# Altium schematic sheet Power_management.SchDoc: Power management
size A4; Date: Not used; ApprovedBy: Not used; CheckedBy: Not used; Author: Not used; CompanyName: STMicroelectronics; DrawnBy: Not used; Engineer: Not used; Organization: Not used; Address1: Not used; Address2: Not used; Address3: Not used; Address4: Not used; DocumentNumber: Not used; Revision: Not used; SheetNumber: 7; SheetTotal: 8; CurrentTime: Not used; CurrentDate: Not used; Time: Not used; DocumentFullPathAndName: Not used; DocumentName: Not used; ModifiedDate: Not used; ImagePath: Not used; ProjectName: Not used; Application_BuildNumber: Not used
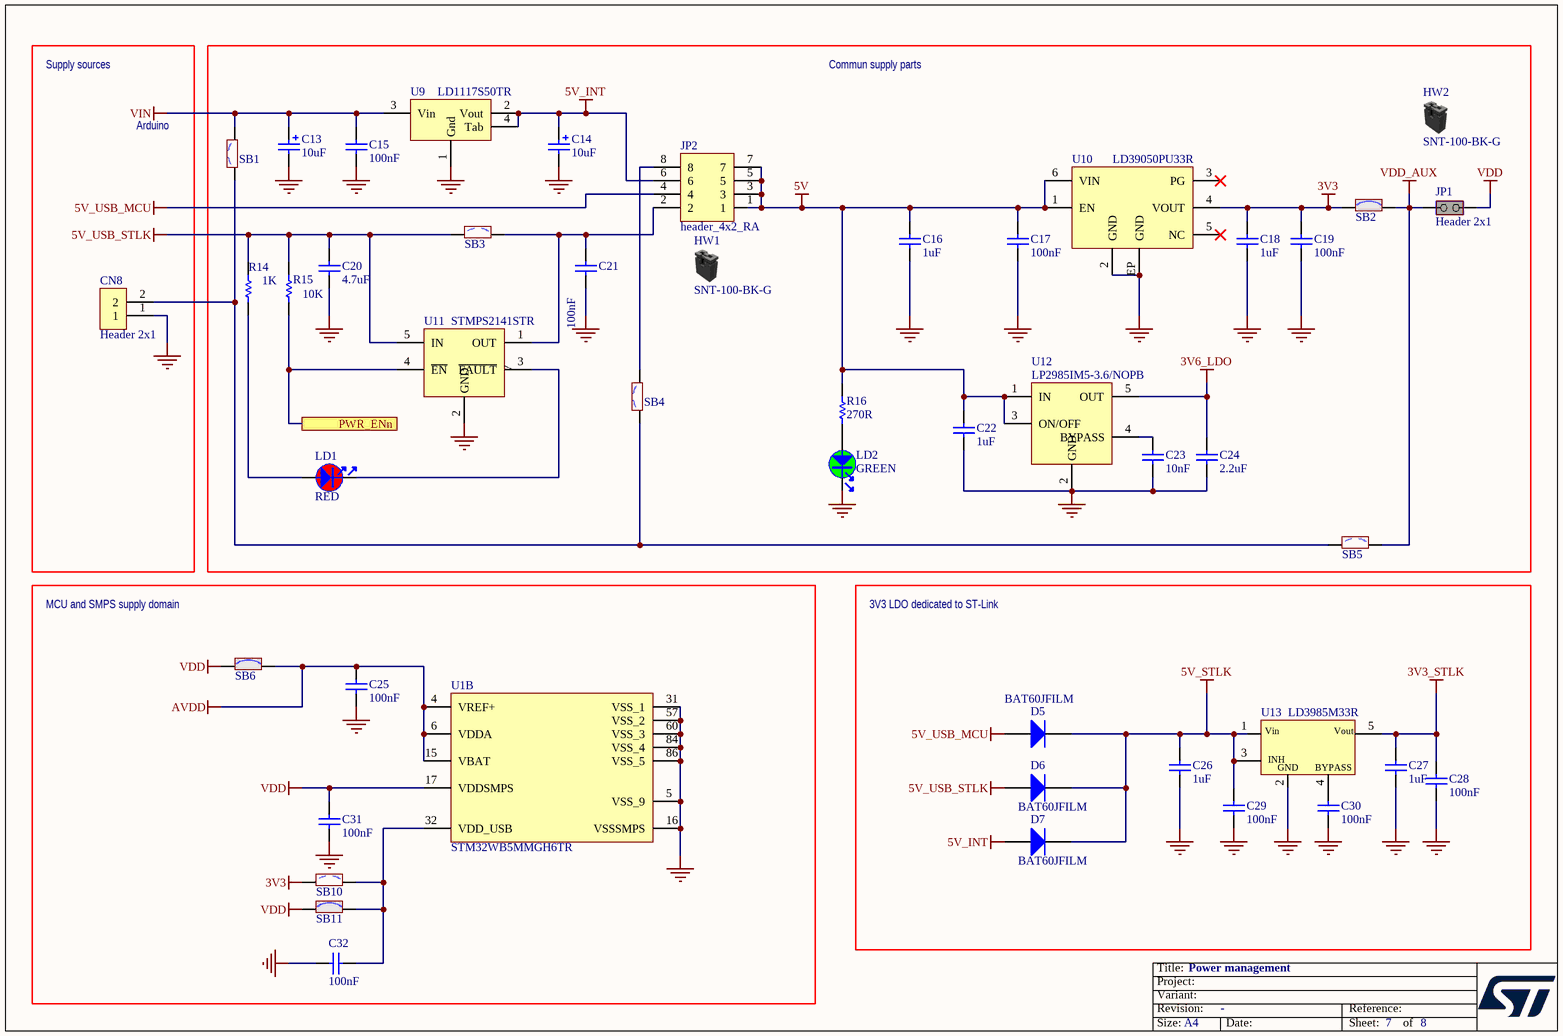
[diagram p0: Power_management.SchDoc]

## Parts
C13  value 10uF  [CPOL_TAJ-B_1210_H210]  (hidden comment: Cap_POL_TANA)
C14  value 10uF  [CPOL_TAJ-B_1210_H210]  (hidden comment: Cap_POL_TANA)
C15  value 100nF  [C0805_H0P85]  (hidden comment: Capacitor)
C16  value 1uF  [C0805_H0P85]  (hidden comment: Capacitor)
C17  value 100nF  [C0201_H0P3]  (hidden comment: Capacitor)
C18  value 1uF  [C0805_H0P85]  (hidden comment: Capacitor)
C19  value 100nF  [C0201_H0P3]  (hidden comment: Capacitor)
C20  value 4.7uF  [C0603_H0P8]  (hidden comment: Capacitor)
C21  value 100nF  [C0805_H0P85]  (hidden comment: Capacitor)
C22  value 1uF  [C0603]  (hidden comment: Capacitor)
C23  value 10nF  [C0603]  (hidden comment: Capacitor)
C24  value 2.2uF  [C0603]  (hidden comment: Capacitor)
C25  value 100nF  [C0201_H0P3]  (hidden comment: Capacitor)
C26  value 1uF  [C0402]  (hidden comment: Capacitor)
C27  value 1uF  [C0402]  (hidden comment: Capacitor)
C28  value 100nF  [C0201_H0P3]  (hidden comment: Capacitor)
C29  value 100nF  [C0201_H0P3]  (hidden comment: Capacitor)
C30  value 100nF  [C0201_H0P3]  (hidden comment: Capacitor)
C31  value 100nF  [C0201_H0P3]  (hidden comment: Capacitor)
C32  value 100nF  [C0201_H0P3]  (hidden comment: Capacitor)
CN8  Header 2x1  [CON_LYCONN_313102S141346]
D5  BAT60JFILM  [DIO_SOD323]
D6  BAT60JFILM  [DIO_SOD323]
D7  BAT60JFILM  [DIO_SOD323]
HW1  value SNT-100-BK-G  (hidden comment: Shunt Black 2.54mm)  (mechanical)
HW2  value SNT-100-BK-G  (hidden comment: Shunt Black 2.54mm)  (mechanical)
JP1  value Header 2x1  [CON_SAMTEC_TSW-102-07-G-S]  (hidden comment: Jumper_Header 2x1 Fitted)
JP2  value header_4x2_RA  [CON_SAMTEC_TSW-104-08-F-D-RA]  (hidden comment: Header 4x2)
LD1  value RED  [LED_0603_VISHAY_VLMS1300-GS08_RED_1A2K_H0P8]  (hidden comment: LED_red)
LD2  value GREEN  [LED_0603_OSRAM_LG-Q396-PS-35_GREEN_1A2K_H0P4]  (hidden comment: LED_green)
R14  value 1K  [R0603]  (hidden comment: Resistor)
R15  value 10K  [R0603]  (hidden comment: Resistor)
R16  value 270R  [R0603]  (hidden comment: Resistor)
SB1  SB_OFF  [SOLDER-BRIDGE_R0603-0R]  (value not drawn)
SB2  SB_ON  [SOLDER-BRIDGE_R0603-0R]  (value not drawn)
SB3  SB_OFF  [SOLDER-BRIDGE_R0603-0R]  (value not drawn)
SB4  SB_OFF  [SOLDER-BRIDGE_R0603-0R]  (value not drawn)
SB5  SB_OFF  [SOLDER-BRIDGE_R0603-0R]  (value not drawn)
SB6  SB_ON  [SOLDER-BRIDGE_R0603-0R]  (value not drawn)
SB10  SB_OFF  [SOLDER-BRIDGE_R0603-0R]  (value not drawn)
SB11  SB_ON  [SOLDER-BRIDGE_R0603-0R]  (value not drawn)
U1  STM32WB5MMGH6TR  [MOD_DORY_STM_86P_7P3X11_H1P342]  (part B of 2)
U9  LD1117S50TR  [REG_SOT223-TAB]
U10  LD39050PU33R  [ICC_DFN6-EPAD_3X3_P095]
U11  STMPS2141STR  [MOS_SOT23-5L]
U12  LP2985IM5-3.6/NOPB  [REG_SOT23-5L]
U13  LD3985M33R  [REG_SOT23-5L]

## Blocks framed on the sheet
Commun supply parts: C13-C24 HW1 HW2 JP1 JP2 LD1 LD2 R14-R16 SB1-SB5 U9-U12
MCU and SMPS supply domain: C25 C31 C32 SB6 SB10 SB11 U1
3V3 LDO dedicated to ST-Link: C26-C30 D5-D7 U13

## Ports
PWR_ENn

## Nets
3V3: C18.2 C19.2 SB2.1 SB10.1 U10.4(VOUT)
3V3_STLK: C27.2 C28.2 U13.5(Vout)
3V6_LDO: C24.2 U12.5(OUT)
5V: C16.2 C17.2 C22.1 JP2.1 JP2.3 JP2.5 JP2.7 R16.2 U10.1(EN) U10.6(VIN) U12.1(IN) U12.3(ON/OFF)
5V_INT: C14.1 D7.1(A) JP2.6 U9.2(Vout) U9.4(Tab)
5V_STLK: C26.2 C29.2 D5.2(K) D6.2(K) D7.2(K) U13.1(Vin) U13.3(CE)
5V_USB_MCU: D5.1(A) JP2.4
5V_USB_STLK: C20.2 D6.1(A) R14.2 R15.2 SB3.1 U11.5(IN)
AVDD: C25.2 SB6.2 U1.4(VREF+) U1.6(VDDA) U1.15(VBAT)
GND: C13.2 C14.2 C15.1 C16.1 C17.1 C18.1 C19.1 C20.1 C21.1 C22.2 C23.1 C24.1 C25.1 C26.1 C27.1 C28.1 C29.1 C30.1 C31.1 C32.2 CN8.1 LD2.2 U1.5(VSS_9) U1.16(VSSSMPS) U1.31(VSS_1) U1.57(VSS_2) U1.60(VSS_3) U1.84(VSS_4) U1.86(VSS_5) U9.1(Gnd) U10.2(GND) U10.EP(GND) U11.2(GND) U12.2(GND) U13.2(GND)
VDD: C31.2 JP1.2(NO) SB6.1 SB11.1 U1.17(VDDSMPS)
VDD_AUX: JP1.1(COMMON) SB2.2 SB5.2
VIN: C13.1 C15.2 SB1.2 U9.3(Vin)
PWR_ENn: R15.1 U11.4(~{EN}) ; port PWR_ENn
NetC21_2: C21.2 JP2.2 SB3.2 U11.1(OUT)
NetC23_2: C23.2 U12.4(BYPASS)
NetC30_2: C30.2 U13.4(BYPASS)
NetC32_1: C32.1 SB10.2 SB11.2 U1.32(VDD_USB)
NetCN8_2: CN8.2 SB1.1 SB4.1 SB5.1
NetJP2_8: JP2.8 SB4.2
NetLD1_1: LD1.1 R14.1
NetLD1_2: LD1.2 U11.3(~{FAULT})
NetLD2_1: LD2.1 R16.1

Not connected (* = marked no-connect by the designer): U10 3(PG)* 5(NC)*

## Notes on the sheet
- Supply sources
- Arduino
- Title:
- Project:
- Size:
- Revision:
- Variant:
- A4
- -
- Date:
- Reference:
- Sheet:
- of
- (in symbol MCD-00086) INH

## Library data of the parts
C13 C14 = MCD-00324: Capacitor, Tantalum, 10uF, 25V,2.5ohms, 10%, pkg Type_B (3528 metric), T=1.9mm; Manufacturer_Part_Number: TAJB106K025RNJ; Manufacturer: AVX; Part_Preference: Recommended; Order_Code_RS: 136-0159; Revision: July-2002: Re-released for DXP Platform.; Internal_Part_Number: MCD-00324; Status: Released; Part_Type: Capacitor; Package: Type_B; ComponentLink1URL: http://tunmcdsvn.tun.st.com/Component_Datasheet_Library/Trunk/Capacitors/AVX_Capacitor_TAJ-series; Order_Code_Digikey: 478-5257-1-ND; Order_Code_Farnell: 2333024
C15 C21 = MCD-01525: Capacitor, MLCC, 100nF, 50V, X7R, 10%, 0805, T=0,85mm; Manufacturer_Part_Number: CC0805KRX7R9BB104; Manufacturer: YAGEO; BMS_Part_Number: 9142249; Part_Preference: Recommended; Order_Code_RS: 669-8842; Internal_Part_Number: MCD-01525; Status: Released; Part_Type: Capacitor; Package: C0805; ComponentLink1URL: http://tunmcdsvn.tun.st.com/Component_Datasheet_Library/Trunk/Capacitors/Yageo_Multilayer_Capacitor_X7R_series_100pF_to_22uF/Yageo_Mutilayer_Capacitor_X7R_100pF_to_22uF.pdf; Order_Code_Digikey: 311-1140-1-ND; Order_Code_Farnell: 3019949
C16 C18 = MCD-01550: Capacitor, MLCC, 1uF, 16V, X5R, +/-10%, 0805, T=0.85mm; Manufacturer_Part_Number: CC0805KRX5R7BB105; Manufacturer: YAGEO; Part_Preference: Recommended; Internal_Part_Number: MCD-01550; Status: Released; Part_Type: Capacitor; Alternate_Manufacturer_Part_Number: N/A; Alternate_Manufacturer: N/A; Package: C0805; ComponentLink1URL: http://tunmcdsvn.tun.st.com/Component_Datasheet_Library/Trunk/Capacitors/Yageo_Multilayer_Capacitor_X7R_series_100pF_to_22uF/YAGEO_MLCC_UPY-GPHC_X7R_6.3V-to-50V_18.pdf; Order_Code_Digikey: 311-3427-1-ND; Order_Code_Farnell: N/A; Order_Code_RS: N/A
C17 C19 C25 C28-C32 = MCD-01535: Capacitor, MLCC,100nF, 10V, X7R, +/-10%, 0201, T=0.3mm; Manufacturer_Part_Number: GRM033R61A104KE15; Manufacturer: MURATA; Part_Preference: Recommended; Order_Code_RS: 790-2742; Internal_Part_Number: MCD-01535; Status: Checked; Part_Type: Capacitor; Package: C0201; ComponentLink1URL: http://tunmcdsvn.tun.st.com/Component_Datasheet_Library/Trunk/Capacitors/Murata_Capacitor_GR_series; Alternate_Manufacturer: N/A; Alternate_Manufacturer_Part_Number: N/A; Order_Code_Digikey: 490-5881-1-ND; Order_Code_Farnell: 2470450
C20 = MCD-01721: Capacitor, MLCC, 4.7uF, 10V, X5R, +/-10%, 0603, T=0.8mm; Manufacturer_Part_Number: CC0603KRX5R6BB475; Manufacturer: YAGEO; Part_Preference: Recommended; Internal_Part_Number: MCD-01721; Status: Released; Part_Type: Capacitor; Package: C0603; ComponentLink1URL: http://tunmcdsvn.tun.st.com/Component_Datasheet_Library/Trunk/Capacitors/Yageo_Multilayer_capacitor_X5R_series_100pF_to_100uF/YAGEO_MLCC_UPY-GPHC_X5R_4V-to-50V_25.pdf; Order_Code_Digikey: 311-1455-1-ND; Order_Code_Farnell: 1458898; Order_Code_RS: N/A
C22 = MCD-00010: Capacitor, MLCC, 1uF, 16V, X5R, +/-10%, 0603, T=0,8mm; Manufacturer_Part_Number: CC0603KRX5R7BB105; Manufacturer: YAGEO; Part_Preference: Recommended; Internal_Part_Number: MCD-00010; Status: Released; Part_Type: Capacitor; Package: C0603; ComponentLink1URL: http://tunmcdsvn.tun.st.com/Component_Datasheet_Library/Trunk/Capacitors/Yageo_Multilayer_capacitor_X5R_series_100pF_to_100uF; Order_Code_Digikey: 311-1444-1-ND; Order_Code_Farnell: 2370680; Order_Code_RS: N/A
C23 = MCD-01007: Capacitor, MLCC, 10nF, 16V, X7R, +/-10%, 0603, T=0.8mm; Manufacturer_Part_Number: CC0603KRX7R7BB103; Manufacturer: YAGEO; Part_Preference: Recommended; Internal_Part_Number: MCD-01007; Status: Released; Part_Type: Capacitor; Package: C0603; ComponentLink1URL: http://tunmcdsvn.tun.st.com/Component_Datasheet_Library/Trunk/Capacitors/Yageo_Multilayer_Capacitor_X7R_series_100pF_to_22uF/; Order_Code_Digikey: 311-3369-1-ND; Order_Code_Farnell: N/A; Order_Code_RS: N/A
C24 = MCD-00012: Capacitor, MLCC, 2.2uF, 10V, X5R, +/- 10%, 0603, T=0,8mm; Manufacturer_Part_Number: CC0603KRX5R6BB225; Manufacturer: YAGEO; Alternate_Manufacturer_Part_Number: C0603C225K8PACTU; Alternate_Manufacturer: KEMET; BMS_Part_Number: 9142010; Part_Preference: Recommended; Internal_Part_Number: MCD-00012; Status: Released; Part_Type: Capacitor; Package: C0603; ComponentLink1URL: http://tunmcdsvn.tun.st.com/Component_Datasheet_Library/Trunk/Capacitors/Yageo_Multilayer_capacitor_X5R_series_100pF_to_100uF; Order_Code_Digikey: 311-1451-1-ND; Order_Code_Farnell: 2370679; Order_Code_RS: N/A
C26 C27 = MCD-01722: Capacitor, MLCC, 1uF, 10V, X5R, +/-10%, 0402, T=0.5mm; Manufacturer_Part_Number: CC0402KRX5R6BB105; Manufacturer: YAGEO; Part_Preference: Recommended; Internal_Part_Number: MCD-01722; Status: Released; Part_Type: Capacitor; Package: C0402; ComponentLink1URL: http://tunmcdsvn.tun.st.com/Component_Datasheet_Library/Trunk/Capacitors/Yageo_Multilayer_capacitor_X5R_series_100pF_to_100uF/Yageo_Multilayer_capacitor_X5R_100pF_to_100uF.pdf; Order_Code_Digikey: 311-1439-1-ND; Order_Code_Farnell: 1458896; Order_Code_RS: N/A
CN8 = MCD-01668: Header 2x1, 2.54mm, VR, TH, height 5.84mm/5.08 mm, height total 13.46 mm; Part_Type: Connector; Manufacturer_Part_Number: 313102S141346; Manufacturer: LYCONN; Part_Preference: Recommended; Internal_Part_Number: MCD-01668; Value: Header 2x1; Status: Released; ComponentLink1URL: http://tunmcdsvn.tun.st.com/Component_Datasheet_Library/Trunk/Connectors/LYCONN_31XXX_2.54mm_L13.46mm/LYCONN_31XXX_2.54mm_L13.46mm.pdf
D5-D7 = MCD-00034: Manufacturer: STMICROELECTRONICS; Part_Type: Diode; BMS_Part_Number: 9151097; Part_Preference: Recommended; Manufacturer_HQ_COO: EU; Internal_Part_Number: MCD-00034; Value: BAT60JFILM; Manufacturer_Part_Number: BAT60JFILM; Status: Released; ComponentLink1URL: http://tunmcdsvn.tun.st.com/Component_Datasheet_Library/Trunk/Diodes/STM_Diode_BAT60JFILM-SOD323
HW1 HW2 = MCD-00043: SHUNT 2.54mm BLACK; Part_Type: Misc; Manufacturer: SAMTEC; Alternate_Manufacturer_Part_Number: 316102S111A; Alternate_Manufacturer: JIUBABA; Part_Preference: Recommended; Internal_Part_Number: MCD-00043; Status: Released; Manufacturer_Part_Number: SNT-100-BK-G; ComponentLink1URL: http://tunmcdsvn.tun.st.com/Component_Datasheet_Library/Trunk/Connectors/Samtec_Shunt_Jumper_SNT100
JP1 = MCD-01904: Header, 2x1, 2,54mm, VR, TH, Height 5.84mm/2.54mm - Shunt Fitted by default; Part_Type: Connector; Manufacturer_Part_Number: TSW-102-07-G-S; Manufacturer: SAMTEC; Part_Preference: Recommended; Order_Code_RS: 155-7981; Internal_Part_Number: MCD-01904; Status: Checked; ComponentLink1URL: http://tunmcdsvn.tun.st.com/Component_Datasheet_Library/Trunk/Connectors/Samtec_TSW-HTSW-series; Alternate_Manufacturer: N/A; Alternate_Manufacturer_Part_Number: N/A; Order_Code_Digikey: SAM1029-02-ND; Order_Code_Farnell: 2505044
JP2 = MCD-02037: Header, 4x2, 2,29mm, RA, TH, height 5,84mm; Part_Type: Connector; Manufacturer_Part_Number: TSW-104-08-F-D-RA; Manufacturer: SAMTEC; Part_Preference: Recommended; Internal_Part_Number: MCD-02037; Status: Released; ComponentLink1URL: http://tunmcdsvn.tun.st.com/Component_Datasheet_Library/Trunk/Connectors/Samtec_TSW-HTSW-series/; Order_Code_Digikey: SAM13034-ND; Order_Code_Farnell: 2032652; Order_Code_RS: N/A; Alternate_Manufacturer_Part_Number: N/A; Alternate_Manufacturer: N/A
LD1 = MCD-00587: LED Red, 0603 SMD, 2V Forward Voltage; Part_Type: Display; Part_Preference: Recommended; Manufacturer: VISHAY; Manufacturer_Part_Number: VLMS1300-GS08; Full_Alternate_Internal_Part_Number: MCD-02401; Component_Country_Of_Origin: China; ShowFields: YES; ID: 3154; Internal_Part_Number: MCD-00587; Status: Released; Package: LED 0603; ComponentLink1URL: http://tunmcdsvn.tun.st.com/Component_Documentation_Library/Trunk/Display/VISHAY_VLMx1300-GS08_Series; Order_Code_Digikey: VLMS1300-GS08CT-ND; Order_Code_Farnell: 2078728; Order_Code_RS: N/A
LD2 = MCD-00588: LED Green, 0603 SMD, Forward Voltage Typ=2V, Max=2.5V; Part_Type: Display; Manufacturer_Part_Number: LG Q396-PS-35; Manufacturer: OSRAM OPTO SEMICONDUCTORS; Alternate_Manufacturer_Part_Number: VLMTG1300-GS08; Alternate_Manufacturer: VISHAY SEMICONDUCTOR OPTO DIVISION; Part_Preference: Recommended; Internal_Part_Number: MCD-00588; Status: Released; Package: LED 0603; ComponentLink1URL: http://tunmcdsvn.tun.st.com/Component_Datasheet_Library/Trunk/Display/OSRAM_LED_GREEN_LG Q396-PS-35; Order_Code_Digikey: LG Q396-PS-35-ND
R14 = MCD-00070: Resistor,1K,0603,1%,1/10W; Manufacturer_Part_Number: RC0603FR-071KL; Manufacturer: YAGEO; Part_Preference: Recommended; Internal_Part_Number: MCD-00070; Status: Released; Part_Type: Resistor; Package: R0603; ComponentLink1URL: http://tunmcdsvn.tun.st.com/Component_Datasheet_Library/Trunk/Resistors/Yageo_Resistor_RC0603-series; Order_Code_Digikey: 311-1.00KHRCT-ND; Order_Code_Farnell: 9238484RL; Order_Code_RS: N/A
R15 = MCD-00220: Resistor,10K,0603,1%,1/10W; Manufacturer_Part_Number: RC0603FR-0710KL; Manufacturer: YAGEO; Part_Preference: Recommended; Internal_Part_Number: MCD-00220; Status: Released; Part_Type: Resistor; Package: R0603; ComponentLink1URL: http://tunmcdsvn.tun.st.com/Component_Datasheet_Library/Trunk/Resistors/Yageo_Resistor_RC0603-series; Order_Code_Digikey: 311-10.0KHRCT-ND; Order_Code_Farnell: 9238603; Order_Code_RS: N/A
R16 = MCD-00442: Resistor,270R,0603,1%,1/10W; Manufacturer_Part_Number: RC0603FR-07270RL; Manufacturer: YAGEO; Part_Preference: Recommended; Internal_Part_Number: MCD-00442; Status: Released; Part_Type: Resistor; Package: R0603; ComponentLink1URL: http://tunmcdsvn.tun.st.com/Component_Datasheet_Library/Trunk/Resistors/Yageo_Resistor_RC0603-series; Order_Code_Digikey: 311-270HRCT-ND; Order_Code_Farnell: 9238417; Order_Code_RS: N/A
SB1 SB3-SB5 SB10 = MCD-00072: Solder Bridge OFF; Part_Type: Misc; Manufacturer_Part_Number: RC0603JR-070RL; Manufacturer: YAGEO; Part_Preference: Recommended; Internal_Part_Number: MCD-00072; Status: Released; Package: SB0603; ComponentLink1URL: http://tunmcdsvn.tun.st.com/Component_Datasheet_Library/Trunk/Resistors/Yageo_Resistor_RC0603-series
SB2 SB6 SB11 = MCD-00071: Solder Bridge ON; Part_Type: Misc; Manufacturer_Part_Number: RC0603JR-070RL; Manufacturer: YAGEO; Part_Preference: Recommended; Internal_Part_Number: MCD-00071; Status: Released; Package: SB0603; ComponentLink1URL: http://tunmcdsvn.tun.st.com/Component_Datasheet_Library/Trunk/Resistors/Yageo_Resistor_RC0603-series
U1 = MCD-01965: STM32 BLE module based on STM32WB55; Part_Type: Misc; Manufacturer: STMICROELECTRONICS; Part_Preference: Recommended; Manufacturer_HQ_COO: EU; Component_Country_Of_Origin: Taiwan; Value: STM32WB5MMGH6TR; Order_Code_Digikey: N/A; Order_Code_Farnell: N/A; Order_Code_RS: N/A; Status: Checked; ComponentLink1URL: http://tunmcdsvn.tun.st.com/Component_Datasheet_Library/Trunk/Misc/STM_STM32WBxxx_dory_module; Internal_Part_Number: MCD-01965; Manufacturer_Part_Number: STM32WB5MMGH6TR; Alternate_Manufacturer_Part_Number: N/A; Alternate_Manufacturer: N/A
U9 = MCD-00088: IC REG LDO 5V 0.8A SOT223; Manufacturer: STMICROELECTRONICS; BMS_Part_Number: 9176133; Part_Preference: Recommended; Manufacturer_HQ_COO: EU; Internal_Part_Number: MCD-00088; Value: LD1117S50TR; Status: Released; Part_Type: IC; Manufacturer_Part_Number: LD1117S50TR; Package: SOT-223; ComponentLink1URL: http://tunmcdsvn.tun.st.com/Component_Datasheet_Library/Trunk/IC/STM_LDO_LD1117
U10 = MCD-00215: Low quiescent current and low noise voltage regulators; Part_Type: IC; Manufacturer: STMICROELECTRONICS; BMS_Part_Number: 9176126; Part_Preference: Recommended; Manufacturer_HQ_COO: EU; Internal_Part_Number: MCD-00215; Value: LD39050PU33R; Status: Released; Manufacturer_Part_Number: LD39050PU33R; Package: DFN6 3x3mm; ComponentLink1URL: http://tunmcdsvn.tun.st.com/Component_Datasheet_Library/Trunk/IC/STM_LDO_LD39050PU
U11 = MCD-00083: Enhanced single channel power switches with active low enable pin; Part_Type: IC; Manufacturer: STMICROELECTRONICS; Alternate_Manufacturer_Part_Number: TPS2041C; Alternate_Manufacturer: TEXAS INSTRUMENTS; BMS_Part_Number: 9159003; Part_Preference: Recommended; Manufacturer_HQ_COO: EU; Internal_Part_Number: MCD-00083; Value: STMPS2141STR; Status: Released; Manufacturer_Part_Number: STMPS2141STR; ComponentLink1URL: http://tunmcdsvn.tun.st.com/Component_Datasheet_Library/Trunk/IC/STM_PWR-Switch_STMPS2141STR
U12 = MCD-01030: LDO VOLTAGE REGULATOR, 3.6V, 150mA, 5-SOT-23, FULL REEL; Part_Type: IC; Manufacturer: TEXAS INSTRUMENTS; Part_Preference: Recommended; Order_Code_RS: 651-9948; Internal_Part_Number: MCD-01030; Value: LP2985IM5-3.6/NOPB; Status: Checked; Manufacturer_Part_Number: LP2985IM5-3.6/NOPB; Package: REG_SOT23-5L; ComponentLink1URL: http://tunmcdsvn.tun.st.com/Component_Datasheet_Library/Trunk/IC/TI_LDO_LP2985IM5-3.6; Alternate_Manufacturer: N/A; Alternate_Manufacturer_Part_Number: N/A; Order_Code_Digikey: LP2985IM5-3.6/NOPBCT-ND; Order_Code_Farnell: 3007634
U13 = MCD-00086: Ultra low drop-low noise BiCMOS voltage, regulators low ESR capacitors compatible; Part_Type: IC; Manufacturer: STMICROELECTRONICS; BMS_Part_Number: 9176161; Part_Preference: Recommended; Manufacturer_HQ_COO: EU; Internal_Part_Number: MCD-00086; Value: LD3985M33R; Status: Released; Manufacturer_Part_Number: LD3985M33R; ComponentLink1URL: http://tunmcdsvn.tun.st.com/Component_Datasheet_Library/Trunk/IC/STM_LDO_LD3985